# EAGLE design PRINT (EAGLE 8.6.0)
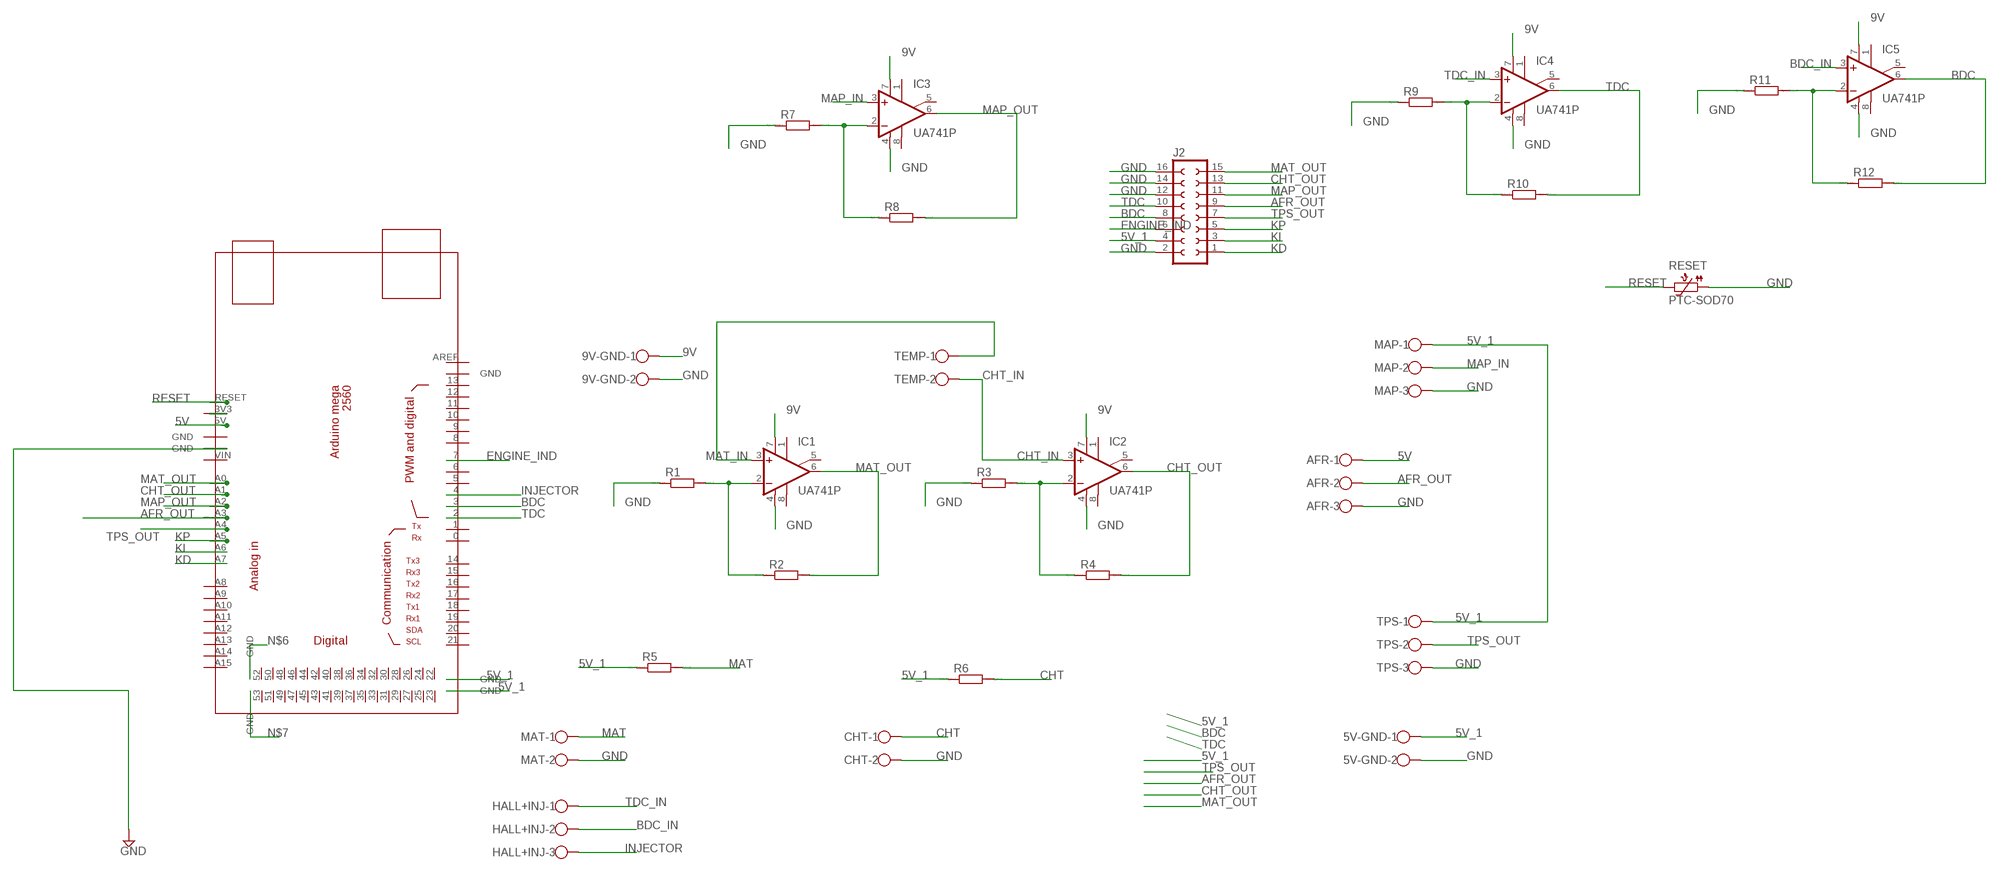
[diagram p0: schematic, sheet 1]

## Parts
5V-GND  W237-102  [W237-102]
9V-GND  W237-102  [W237-102]
AFR  W237-103  [W237-103]
CHT  W237-102  [W237-102]
HALL+INJ  W237-103  [W237-103]
IC1  UA741P  [DIL08]
IC2  UA741P  [DIL08]
IC3  UA741P  [DIL08]
IC4  UA741P  [DIL08]
IC5  UA741P  [DIL08]
J2  SOCKET-16V  [S16V]
MAP  W237-103  [W237-103]
MAT  W237-102  [W237-102]
R1  R0204/7  [0204/7]
R2  R0204/7  [0204/7]
R3  R0204/7  [0204/7]
R4  R0204/7  [0204/7]
R5  R0204/7  [0204/7]
R6  R0204/7  [0204/7]
R7  R0204/7  [0204/7]
R8  R0204/7  [0204/7]
R9  R0204/7  [0204/7]
R10  R0204/7  [0204/7]
R11  R0204/7  [0204/7]
R12  R0204/7  [0204/7]
RESET  PTC-SOD70  [SOD70]
TEMP  W237-102  [W237-102]
TPS  W237-103  [W237-103]
U$1  MEGA_DEVICE  [MEGAOUTLINE]

## Nets
5V: AFR.1 U$1.5V
5V_1: 5V-GND.1 J2.4 MAP.1 R5.1 R6.1 TPS.1 U$1.GND@4(GND) U$1.GND@5(GND)
9V: 9V-GND.1 IC1.7(V+) IC2.7(V+) IC3.7(V+) IC4.7(V+) IC5.7(V+)
AFR_OUT: AFR.2 J2.9 U$1.A3
BDC: IC5.6(OUT) J2.8 R12.2 U$1.3
BDC_IN: HALL+INJ.2 IC5.3(+IN)
CHT: CHT.1 R6.2
CHT_IN: IC2.3(+IN) TEMP.2
CHT_OUT: IC2.6(OUT) J2.13 R4.2 U$1.A1
ENGINE_IND: J2.6 U$1.7
GND: 5V-GND.2 9V-GND.2 AFR.3 CHT.2 IC1.4(V-) IC2.4(V-) IC3.4(V-) IC4.4(V-) IC5.4(V-) J2.2 J2.12 J2.14 J2.16 MAP.3 MAT.2 R1.1 R3.1 R7.1 R9.1 R11.1 RESET.1 TPS.3 U$1.GND@3(GND)
INJECTOR: HALL+INJ.3 U$1.4
KD: J2.1 U$1.A7
KI: J2.3 U$1.A6
KP: J2.5 U$1.A5
MAP_IN: IC3.3(+IN) MAP.2
MAP_OUT: IC3.6(OUT) J2.11 R8.2 U$1.A2
MAT: MAT.1 R5.2
MAT_IN: IC1.3(+IN) TEMP.1
MAT_OUT: IC1.6(OUT) J2.15 R2.2 U$1.A0
N$1: IC1.2(-IN) R1.2 R2.1
N$2: IC2.2(-IN) R3.2 R4.1
N$3: IC3.2(-IN) R7.2 R8.1
N$4: U$1.3V3
N$6: U$1.GND@6(GND)
N$7: U$1.GND@7(GND)
N$8: IC4.2(-IN) R9.2 R10.1
N$9: IC5.2(-IN) R11.2 R12.1
RESET: RESET.2 U$1.RESET
TDC: IC4.6(OUT) J2.10 R10.2 U$1.2
TDC_IN: HALL+INJ.1 IC4.3(+IN)
TPS_OUT: J2.7 TPS.2 U$1.A4
Unconnected: IC1.1(ON1) IC1.5(ON2) IC1.8(OPT) IC2.1(ON1) IC2.5(ON2) IC2.8(OPT) IC3.1(ON1) IC3.5(ON2) IC3.8(OPT) IC4.1(ON1) IC4.5(ON2) IC4.8(OPT) IC5.1(ON1) IC5.5(ON2) IC5.8(OPT) U$1.0 U$1.1 U$1.5 U$1.6 U$1.8 U$1.9 U$1.10 U$1.11 U$1.12 U$1.13 U$1.14 U$1.15 U$1.16 U$1.17 U$1.18 U$1.19 U$1.20 U$1.21 U$1.22 U$1.23 U$1.24 U$1.25 U$1.26 U$1.27 U$1.28 U$1.29 U$1.30 U$1.31 U$1.32 U$1.33 U$1.34 U$1.35 U$1.36 U$1.37 U$1.38 U$1.39 U$1.40 U$1.41 U$1.42 U$1.43 U$1.44 U$1.45 U$1.46 U$1.47 U$1.48 U$1.49 U$1.50 U$1.51 U$1.52 U$1.53 U$1.A8 U$1.A9 U$1.A10 U$1.A11 U$1.A12 U$1.A13 U$1.A14 U$1.A15 U$1.AREF U$1.GND@1(GND) U$1.GND@2(GND) U$1.VIN

## Library data of the parts
5V-GND 9V-GND CHT MAT TEMP = con-wago-500:W237-102: WAGO SCREW CLAMP; MPN: 237-102; OC_FARNELL: unknown; OC_NEWARK: 70K9898
AFR HALL+INJ MAP TPS = con-wago-500:W237-103: WAGO SCREW CLAMP; MPN: 237-103; OC_FARNELL: unknown; OC_NEWARK: 18M7116
IC1-IC5 = linear:*741: OP AMP
J2 = con-3m-skt-header:SOCKET-16: 16 pin PCB Socket (3m 85xx/51xx)
R1-R12 = eagle-ltspice:R: RESISTOR, European symbol; SPICEMODEL: NONE; SPICEPREFIX: R
RESET = ptc-ntc:PTC-: Positive Temperature Coefficient Resistor (PTC) termistor Philips KTY81-210 - KTY81-252 Source: 153627-da-01-en-Temperatur-Sensor_KTY10-6_Philips.pdf; OC_FARNELL: unknown; OC_NEWARK: unknown
U$1 = ArduinoMegaOutline:MEGA_DEVICE: mega card as device

## Net classes
0 default: width 0.381 mm, clearance 0.381 mm
1 pwr: width 0.381 mm, clearance 0.381 mm
2 raw: width 0.381 mm, clearance 0.381 mm

## Board
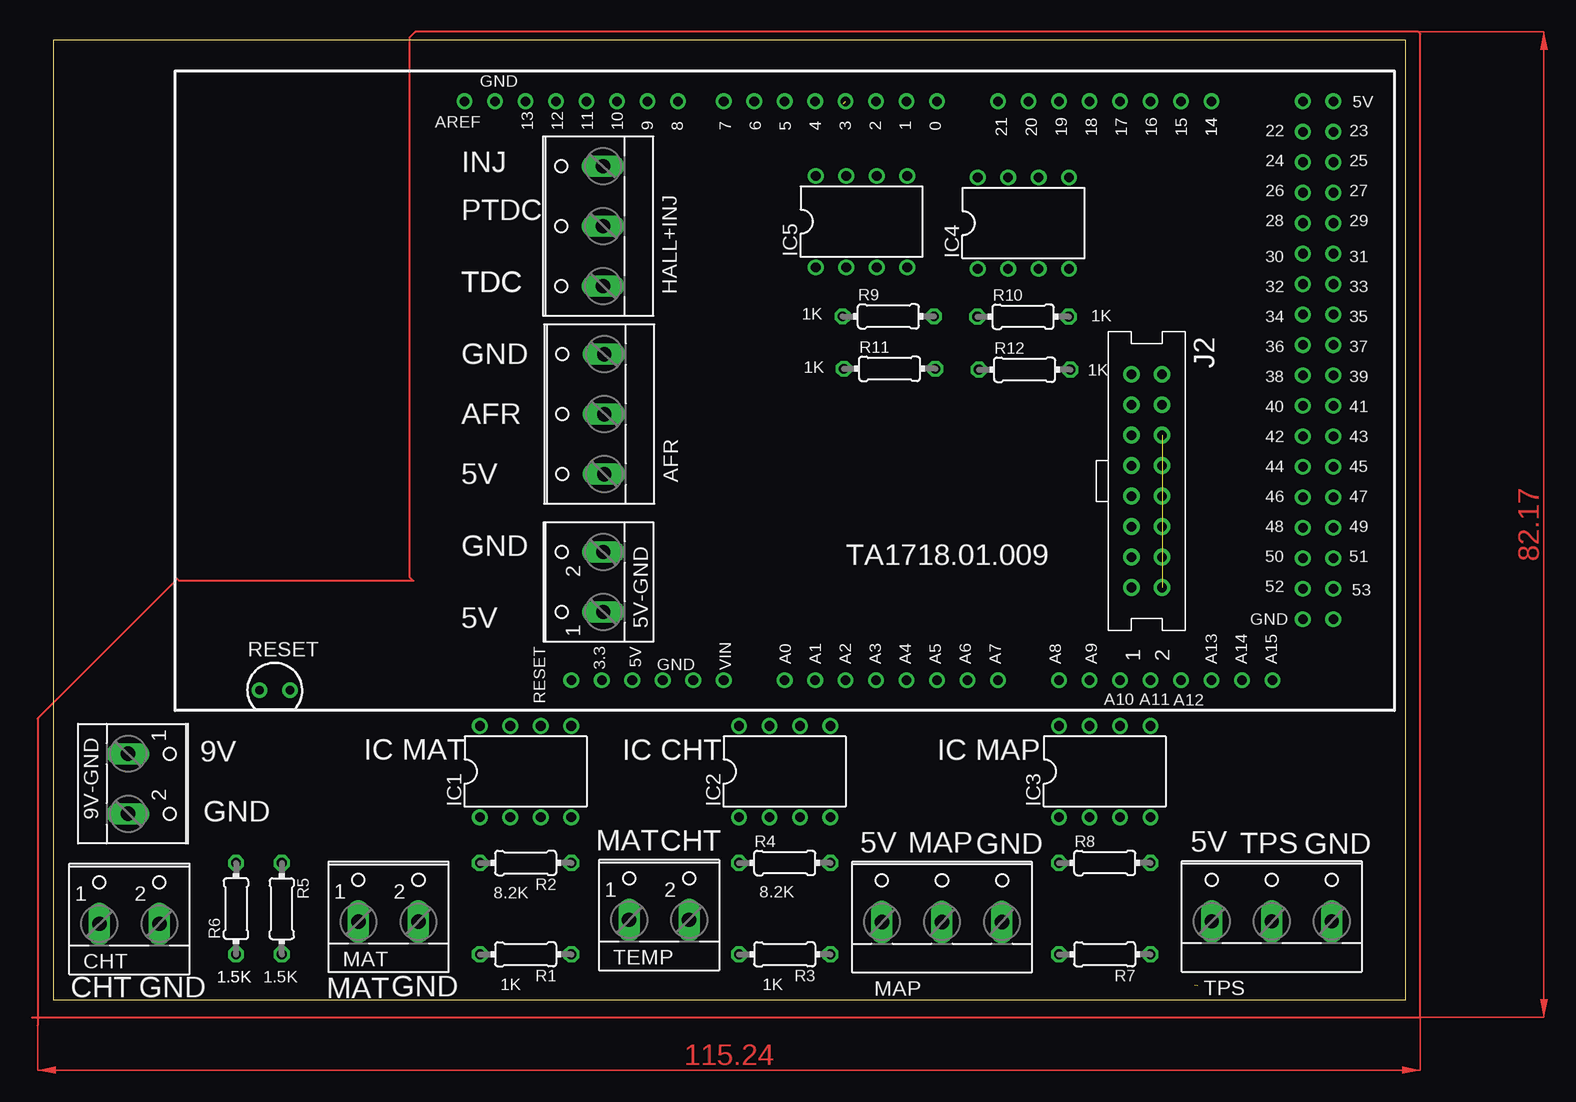
[diagram p1: board, top side]
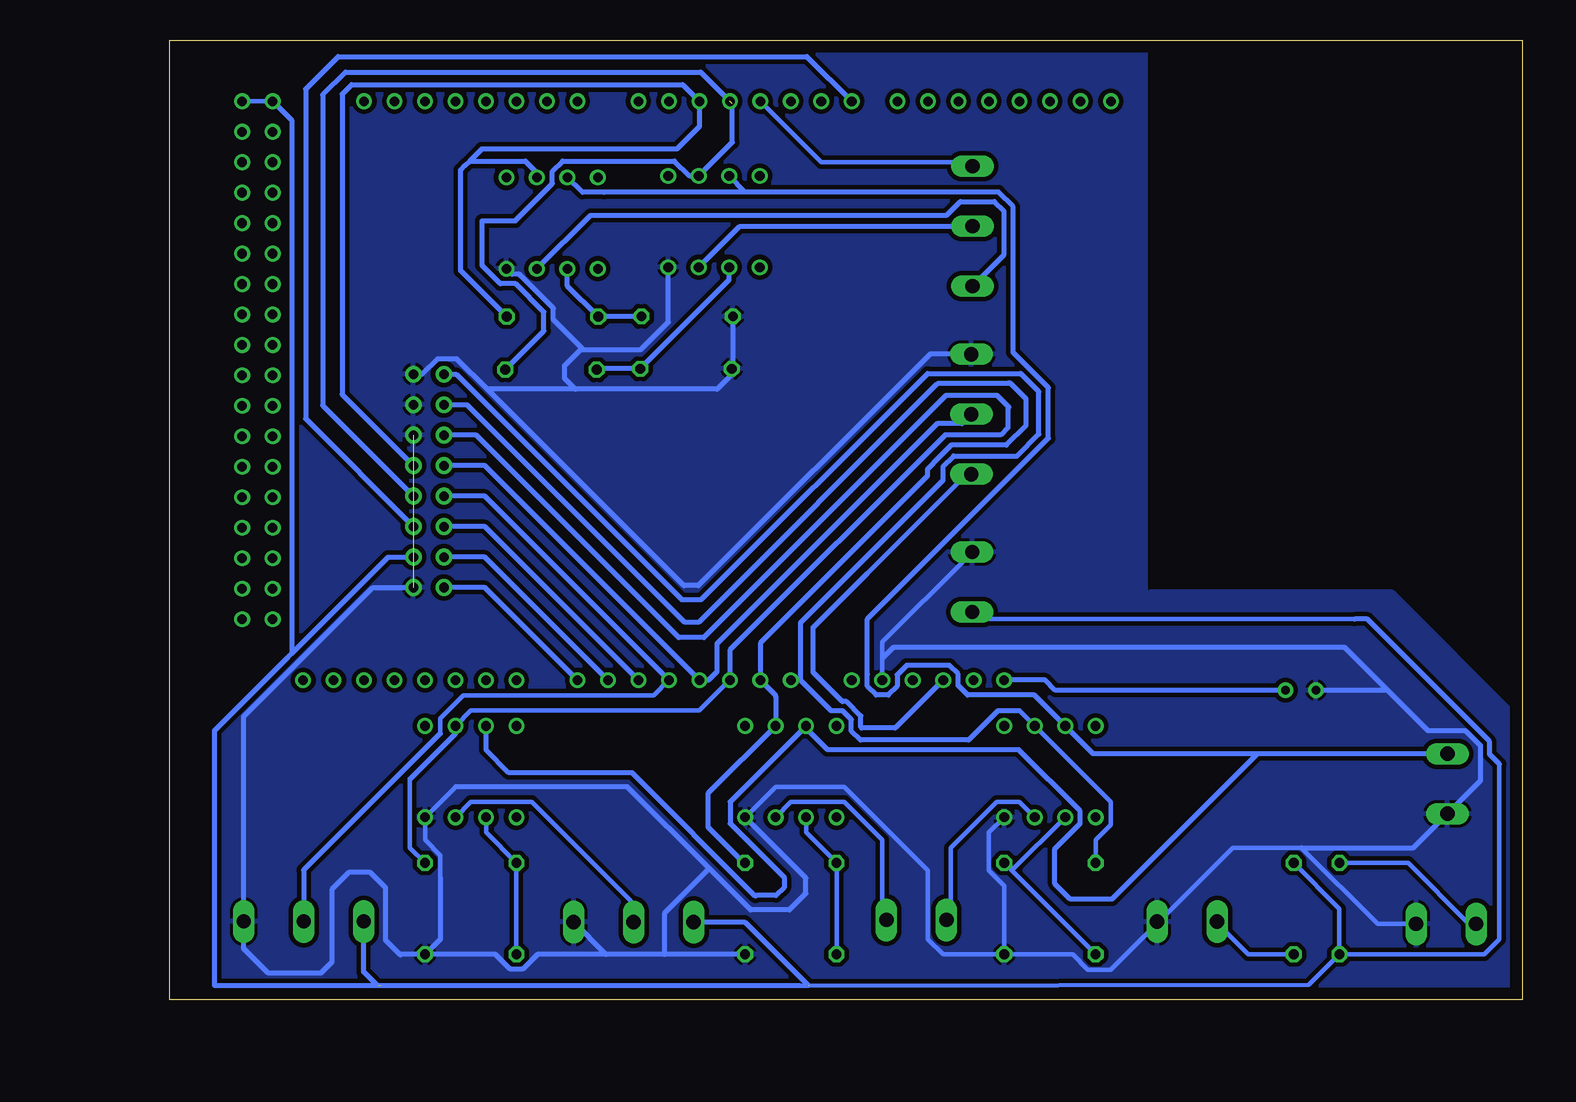
[diagram p2: board, bottom side, seen from below]

Size 112.7 x 80 mm. Coordinates in mm from the lower left corner, seen from the top.
Outline: 0,0 112.7,0 112.7,80 0,80 0,0
Copper layers (1*16): Top 0.035mm / dielectric 1.5mm / Bottom 0.035mm
Design rules "default": minimum track width 6mil, minimum drill 0.35mm, track to track 6mil, track to pad 6mil, pad to pad 6mil, via to via 6mil, smd to smd 6mil, copper to edge 40mil, drill to drill 6mil, minimum pad ring 10mil, minimum via ring 8mil, stop-mask expansion 4mil, vias tented up to drill 0mil, thermal gap 10mil

### Footprints (pad centres in the part's own frame; a part is rotated, then mirrored left to right if it is on the bottom)
W237-102 = drill 1.194 long: 1 -2.5,-1.27; 2 2.5,-1.27
W237-103 = drill 1.194 long: 1 -5,-1.29; 2 0,-1.29; 3 5,-1.29
DIL08 = drill 0.813 pad 1.27: 1 -3.81,-3.81; 2 -1.27,-3.81; 3 1.27,-3.81; 4 3.81,-3.81; 5 3.81,3.81; 6 1.27,3.81; 7 -1.27,3.81; 8 -3.81,3.81
S16V = drill 0.8 pad 1.4: 1 8.89,-1.27; 2 8.89,1.27; 3 6.35,-1.27; 4 6.35,1.27; 5 3.81,-1.27; 6 3.81,1.27; 7 1.27,-1.27; 8 1.27,1.27; 9 -1.27,-1.27; 10 -1.27,1.27; 11 -3.81,-1.27; 12 -3.81,1.27; 13 -6.35,-1.27; 14 -6.35,1.27; 15 -8.89,-1.27; 16 -8.89,1.27
0204/7 = drill 0.813 octagon: 1 -3.81,0; 2 3.81,0
SOD70 = drill 0.7 pad 1.27: 1 -1.27,0; 2 1.27,0
MEGAOUTLINE = drill 0.8: 0 12.7,24.13; 1 10.16,24.13; 2 7.62,24.13; 3 5.08,24.13; 3V3 -15.24,-24.13; 4 2.54,24.13; 5 0,24.13; 5V -12.7,-24.13; 6 -2.54,24.13; 7 -5.08,24.13; 8 -8.89,24.13; 9 -11.43,24.13; 10 -13.97,24.13; 11 -16.51,24.13; 12 -19.05,24.13; 13 -21.59,24.13; 14 17.78,24.13; 15 20.32,24.13; 16 22.86,24.13; 17 25.4,24.13; 18 27.94,24.13; 19 30.48,24.13; 20 33.02,24.13; 21 35.56,24.13; 22 43.18,21.59; 23 45.72,21.59; 24 43.18,19.05; 25 45.72,19.05; 26 43.18,16.51; 27 45.72,16.51; 28 43.18,13.97; 29 45.72,13.97; 30 43.18,11.43; 31 45.72,11.43; 32 43.18,8.89; 33 45.72,8.89; 34 43.18,6.35; 35 45.72,6.35; 36 43.18,3.81; 37 45.72,3.81; 38 43.18,1.27; 39 45.72,1.27; 40 43.18,-1.27; 41 45.72,-1.27; 42 43.18,-3.81; 43 45.72,-3.81; 44 43.18,-6.35; 45 45.72,-6.35; 46 43.18,-8.89; 47 45.72,-8.89; 48 43.18,-11.43; 49 45.72,-11.43; 50 43.18,-13.97; 51 45.72,-13.97; 52 43.18,-16.51; 53 45.72,-16.51; A0 0,-24.13; A1 2.54,-24.13; A2 5.08,-24.13; A3 7.62,-24.13; A4 10.16,-24.13; A5 12.7,-24.13; A6 15.24,-24.13; A7 17.78,-24.13; A8 22.86,-24.13; A9 25.4,-24.13; A10 27.94,-24.13; A11 30.48,-24.13; A12 33.02,-24.13; A13 35.56,-24.13; A14 38.1,-24.13; A15 40.64,-24.13; AREF -26.67,24.13; GND@1 -24.13,24.13; GND@2 -10.16,-24.13; GND@3 -7.62,-24.13; GND@4 43.18,24.13; GND@5 45.72,24.13; GND@6 43.18,-19.05; GND@7 45.72,-19.05; RESET -17.78,-24.13; VIN -5.08,-24.13

### Placement (x,y rotation side)
5V-GND  44.58,34.85 90 top
9V-GND  7.52,18.03 270 top
AFR  44.63,48.84 90 top
CHT  6.35,7.62 0 top
HALL+INJ  44.53,64.52 90 top
IC1  39.37,19.05 0 top
IC2  60.96,19.05 0 top
IC3  87.63,19.05 0 top
IC4  80.85,64.77 0 top
IC5  67.36,64.9 0 top
J2  91.14,43.28 270 top
MAP  74.07,7.8 0 top
MAT  27.94,7.8 0 top
R1  39.37,3.81 180 top
R2  39.37,11.43 180 top
R3  60.96,3.81 180 top
R4  60.96,11.43 0 top
R5  19.05,7.62 270 top
R6  15.24,7.62 90 top
R7  87.63,3.81 180 top
R8  87.63,11.43 0 top
R9  69.6,57 0 top
R10  80.82,56.97 0 top
R11  69.7,52.63 0 top
R12  80.95,52.55 0 top
RESET  18.47,25.83 0 top
TEMP  50.5,7.95 0 top
TPS  101.55,7.85 0 top
U$1  60.96,50.8 0 top

### Tracks (layer width: path | path; a pad name or v marks a point on that pad's centre or on a via)
5V
  Bottom 0.381: 54.61,35.56 46.35,43.81 AFR.1
  Bottom 0.406: 54.61,35.56 59.11,31.06 59.11,27.33 56.67,24.89 56.31,24.89 55.12,23.7 55.12,22.73 55.06,22.67 52.26,22.67 U$1.5V
5V_1  (2 unrouted)
  Bottom 0.381: U$1.GND@5 U$1.GND@4 | R6.1 15.24,7.62 R5.1 | 60.22,1.19 59.49,1.2 17.78,1.27 R6.1 | 13.97,31.75 45.72,31.75 5V-GND.1 | 1.91,19.68 1.91,5.08 3.17,3.81 R6.1
  Bottom 0.406: 59.49,1.22 59.51,1.22 64.8,6.51 MAP.1 | 60.22,1.19 95.4,1.19 96.55,2.34 TPS.1 | 95.15,1.22 108.97,1.22 108.97,22.48 102.86,28.59 | J2.4 94.51,36.93 102.56,28.88 | 102.86,28.59 102.65,28.79 102.56,28.88 | 102.87,28.6 102.86,28.59 | 1.91,19.68 2.72,20.5 2.72,21.56 12.91,31.75 13.97,31.75 | U$1.GND@4 102.56,73.36 102.56,28.88
9V
  Bottom 0.406: 9V-GND.1 22.09,20.53 | 22.09,20.53 34.21,8.41 37.67,8.41 38.96,9.7 38.96,12.62 36.85,14.72 36.85,15.76 41.95,20.85 57.89,20.85 59.69,22.66 IC2.7 66.02,16.54 66.02,14.72 61.52,10.23 61.52,9.37 62.18,8.71 63.86,8.71 63.91,8.66 74.19,18.95 84.45,18.95 86.36,20.85 IC3.7 | 22.09,20.53 35.77,20.53 IC1.7 40.67,25.43 46.23,25.43 47.02,26.22 47.02,27.18 47.75,27.91 51.31,27.91 52.1,27.12 52.1,26.16 52.83,25.43 53.85,25.43 54.58,26.16 54.58,27.15 54.59,27.15 54.59,31.75 39.5,46.84 39.5,51.05 42.44,54 42.44,66.14 43.67,67.36 64.75,67.36 | 64.75,67.36 IC5.7 | 64.75,67.36 76.5,67.36 76.52,67.33 78.33,67.33 IC4.7
AFR_OUT
  Bottom 0.381: 46.35,48.26 AFR.2
  Bottom 0.406: J2.9 86.46,44.55 U$1.A3 67.82,26.67 67.13,27.36 67.13,29.69 48.76,48.06 46.7,48.06 AFR.2
BDC  (1 unrouted)
  Bottom 0.406: J2.8 99.97,49.58 99.97,75.46 98.07,77.37 68.48,77.37 65.84,74.73 65.84,71.5 IC5.6 69.41,68.71 70.66,69.95 79.97,69.95 80.82,69.1 80.82,68.06 83.91,64.97 86.69,64.97 86.69,61.23 85.17,59.72 83.9,59.72 81.53,57.35 81.53,55.78 R12.2
BDC_IN
  Bottom 0.406: IC5.3 65.2,64.52 HALL+INJ.2
CHT
  Bottom 0.381: R6.2 9.53,11.43 4.45,6.35 CHT.1
CHT_IN
  Bottom 0.381: IC2.3 60.96,16.51 56.52,16.51 53.34,13.34 53.34,6.99 TEMP.2
CHT_OUT
  Bottom 0.406: R4.2 64.87,11.43 67.87,14.43 67.87,17.22 IC2.6 62.23,25.3 arc-45 62.3,25.47 U$1.A1 63.5,29.77 49.58,43.69 49.58,44.25 49.08,44.75 49.08,44.78 47.6,46.26 43,46.26 41.35,47.9 41.35,50.11 42.62,51.39 | 42.62,51.39 arc-45 42.8,51.46 | 42.62,51.39 48.74,51.39 68.61,31.52 69.85,31.52 87.96,49.63 J2.13
ENGINE_IND
  Bottom 0.406: U$1.7 59.61,78.66 98.68,78.66 101.4,75.95 101.4,48.46 J2.6
GND  (1 unrouted)
  Bottom 0.381: 90.17,10.16 90.17,12.06 91.44,13.34 IC3.4 88.9,17.78 | 103.5,26.67 103.21,26.96 | U$1.GND@3 53.34,28.47 53.34,29.84 46.35,36.83 5V-GND.2 | R1.1 43.18,9.53 44.45,10.79 44.45,13.97 IC1.4 | IC2.4 62.23,17.78 56.52,17.78 49.53,10.79 49.53,5.08 48.26,3.81 R1.1 | CHT.2 12.06,6.35 18.41,12.7 24.13,12.7 29.84,6.99 MAT.2 30.48,6.35 34.29,2.54 36.2,2.54 37.47,3.81 R1.1
  Bottom 0.406: IC2.4 59.72,10.19 59.72,8.89 61.09,7.52 64.31,7.52 67.75,10.96 | 88.9,17.78 74.57,17.78 67.75,10.96 | R3.1 71.5,3.81 | 71.5,3.81 76.37,3.81 | 76.37,3.81 MAP.3 | 90.17,10.16 90.17,5.08 R7.1 | R7.1 93.45,3.81 93.5,3.76 94.72,4.98 94.72,9.37 95.99,10.64 97.79,10.64 99.21,9.22 99.21,3.15 100.13,2.23 104.5,2.23 106.55,4.29 TPS.3 106.55,23.63 103.21,26.96 95.78,34.39 J2.2 | 67.75,10.96 71.5,7.21 71.5,3.81 | 76.37,3.81 82.06,3.81 83.3,2.56 84.34,2.56 85.58,3.81 R7.1 | 18.41,12.7 9.08,12.7 9V-GND.2 3.5,18.28 3.5,21.23 4.72,22.45 7.85,22.45 11.23,25.83 | AFR.3 49.36,53.84 68.66,34.54 69.88,34.54 86.26,50.93 | J2.16 91.68,52.17 90.4,53.46 88.79,53.46 86.26,50.93 | R9.1 65.79,52.73 R11.1 65.89,52.15 67.11,50.93 78.92,50.93 | 78.92,50.93 79.81,51.82 79.81,52.91 78.49,54.23 78.26,54.23 | 78.26,54.23 73.46,54.23 71.17,56.52 IC5.4 | 78.26,54.23 80.75,56.72 80.75,57.68 83.57,60.5 84.2,60.5 IC4.4 | 78.92,50.93 86.26,50.93 | 11.23,25.83 RESET.1 | 11.23,25.83 14.78,29.39 52.43,29.39 53.34,28.47
  pour Bottom: 0.28,-0.1 0.28,23.44 10.85,34.01 31.01,34.01 31.37,33.66 31.37,79.88 112.7,79.88 112.73,79.86 112.73,0.08 112.75,0.05 0.43,0.05
INJECTOR
  Bottom 0.381: U$1.4 58.42,69.85 46.35,69.85 HALL+INJ.3
KD
  Bottom 0.406: U$1.A7 86.46,34.39 J2.1
KI
  Bottom 0.406: U$1.A6 86.46,36.93 J2.3
KP
  Bottom 0.406: U$1.A5 86.46,39.47 J2.5
MAP_IN
  Bottom 0.381: IC3.3 87.63,16.51 82.55,16.51 74.3,8.26 MAP.2
MAP_OUT
  Bottom 0.381: U$1.A2 68.58,24.13 87.63,24.13 IC3.6 | R8.2 92.71,12.7 92.71,18.41
  Bottom 0.406: 92.71,18.41 88.9,22.23 IC3.6 | U$1.A2 66.04,29.18 48.11,47.12 43.48,47.12 42.85,47.75 42.85,49.33 42.77,49.4 43.77,50.4 48.03,50.4 68.2,30.23 70.31,30.23 87.17,47.09 J2.11
MAT
  Bottom 0.381: R5.2 22.86,3.81 25.4,6.35 MAT.1
MAT_IN
  Bottom 0.381: IC1.3 41.91,16.51 43.81,16.51 47.62,12.7 47.62,6.99 TEMP.1
MAT_OUT
  Bottom 0.381: 41.91,24.13 IC1.6 34.29,16.51 34.29,14.61 35.56,13.34 R2.2
  Bottom 0.406: J2.15 88.85,52.17 70.05,33.38 68.43,33.38 49.55,52.25 41.81,52.25 40.28,50.72 40.28,47.17 42.09,45.36 47.38,45.36 48.29,44.46 48.29,43.33 60.17,31.45 60.17,26.67 | 41.91,24.13 41.94,24.11 43.7,24.11 46.13,21.67 55.17,21.67 55.91,22.4 55.91,23.38 56.63,24.11 57.61,24.11 60.17,26.67 | 60.17,26.67 U$1.A0
N$1
  Bottom 0.381: R2.1 42.55,10.79 | 42.55,10.79 R1.2 | 42.55,10.79 IC1.2
N$2
  Bottom 0.381: R3.2 R4.1 59.69,13.97 IC2.2
N$3
  Bottom 0.381: R7.2 R8.1 86.36,13.97 IC3.2
N$5
  Top 0.152: -1.78,-1.45 113.94,-1.45 113.94,80.54 113.77,80.72 30.18,80.72 29.69,80.24 29.69,35.28 30.02,34.95 10.49,34.95 10.34,35.1 -1.29,23.47 -1.29,-2.11
N$8
  Bottom 0.406: R9.2 76.99,57 R10.1 79.58,59.54 IC4.2
N$9
  Bottom 0.406: R12.1 77.06,52.63 R11.2 66.09,60.05 IC5.2
RESET
  Bottom 0.406: RESET.2 38.91,25.83 39.75,26.67 U$1.RESET
TDC
  Bottom 0.406: J2.10 98.35,50.49 98.35,75.54 97.56,76.33 69.98,76.33 U$1.2 68.58,72.82 70.46,70.94 86.72,70.94 87.71,69.95 | R10.2 88.47,60.81 88.47,69.19 88.08,69.58 87.71,69.95 | 87.71,69.95 83.08,69.95 82.12,68.99 IC4.6
TDC_IN
  Bottom 0.406: IC4.3 77.65,65.43 47.98,65.43 46.84,66.57 43.99,66.57 43.23,65.81 43.23,62.1 HALL+INJ.1
TPS_OUT
  Bottom 0.381: 90.17,22.23 90.17,23.5 88.27,25.4 72.39,25.4 U$1.A4
  Bottom 0.406: 90.17,22.23 101.55,10.85 TPS.2 | U$1.A4 86.46,42.01 J2.7
(copper drawn outside any net)
  shapes: Top area x2

### Text on the board
tPlace: GND | 5V | AREF | 13 | 12 | 11 | 10 | 9 | 8 | 7 | 6 | 5 | 4 | 3 | 2 | 1 | 0 | 21 | 20 | 19 | 18 | 17 | 16 | 15 | 14 | 14 | 22 | 23 | 24 | 25 | INJ | 26 | 27 | PTDC | 28 | 29 | 30 | 31 | TDC | TDC | 32 | 33 | 1K | 1K | 34 | 35 | 36 | 37 | GND | 1K | 1K | 38 | 39 | 40 | 41 | AFR | 42 | 43 | 44 | 45 | 5V | 46 | 47 | 48 | 49 | GND | TA1718.01.009 | 50 | 51 | 52 | 53 | 5V | GND | RESET | 3.3 | 5V | GND | VIN | A0 | A1 | A2 | A3 | A4 | A5 | A6 | A7 | A8 | A9 | A13 | A14 | A15 | A10 | A11 | A12 | 9V | IC MAT | IC CHT | IC MAP | GND | MAT | CHT | 5V | MAP | GND | 5V | TPS | GND | 8.2K | 8.2K | 1.5K | 1.5K | 1.5K | 1K | 1K | CHT | GND | MAT | GND